# Altium schematic sheet Вариант5.SchDoc
size A4; SheetNumber: 5; SheetTotal: 10
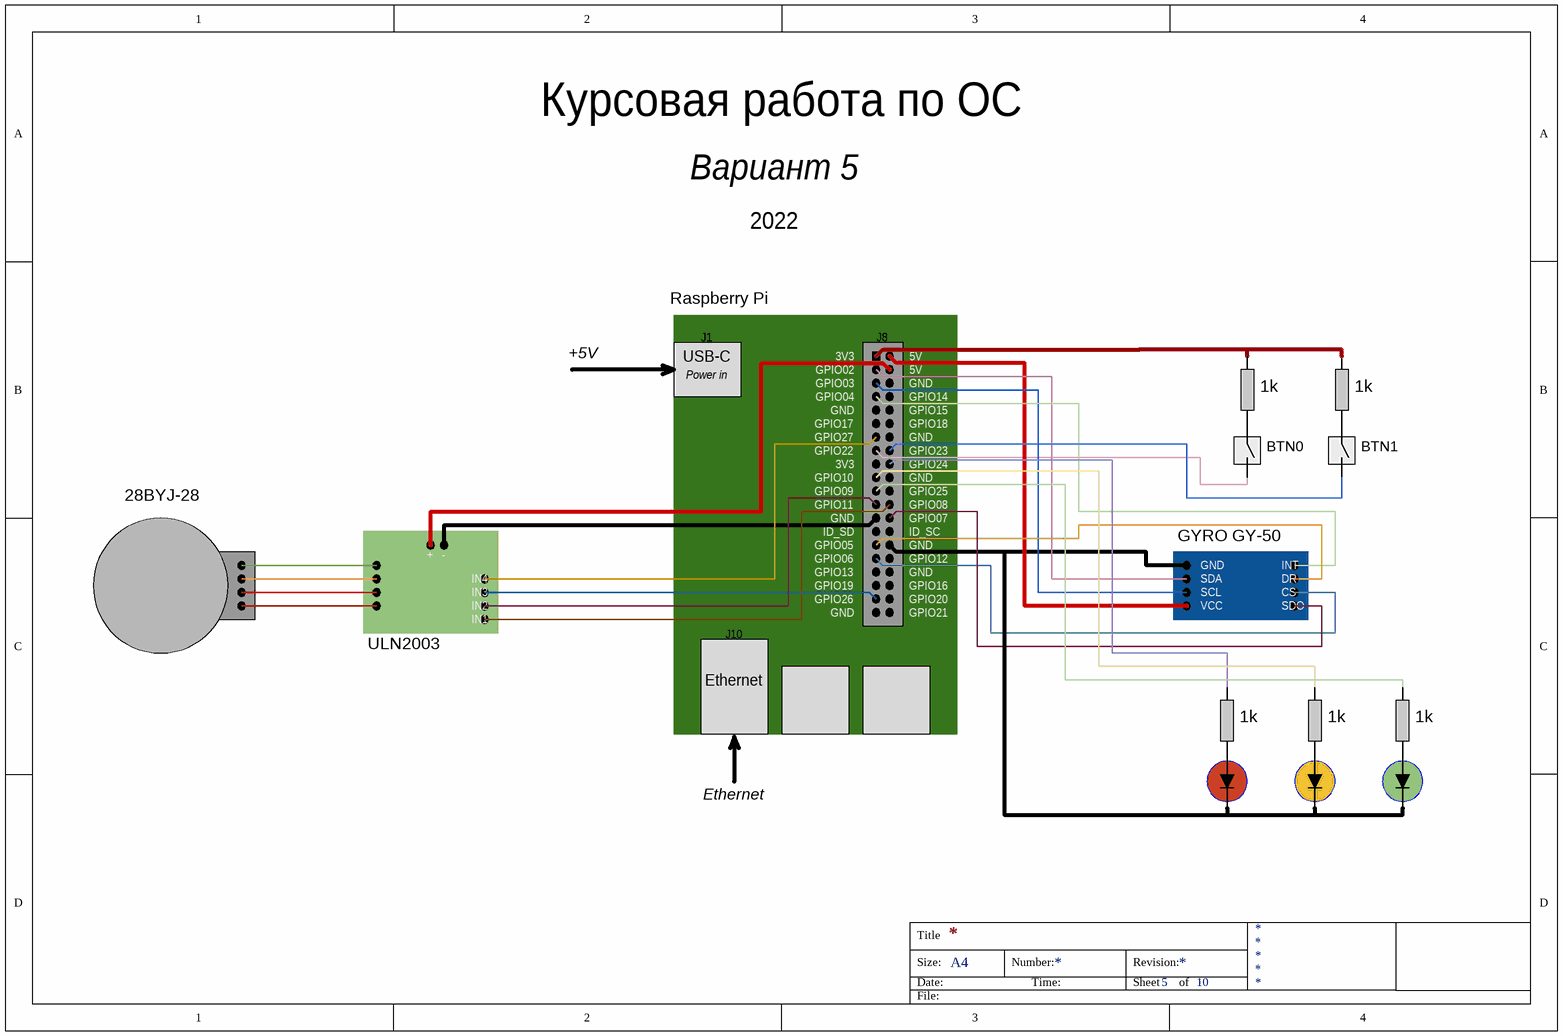
[diagram p0: Вариант5.SchDoc]

## Notes on the sheet
- Курсовая работа по ОС
- Вариант 5
- 2022
- Raspberry Pi
- +5V
- USB-C
- Power in
- J1
- 3V3
- GPIO02
- GPIO03
- J8
- GND
- 5V
- 1k
- GPIO17
- GPIO27
- GPIO22
- GPIO04
- GPIO14
- GPIO15
- GPIO18
- GPIO23
- BTN0
- BTN1
- 28BYJ-28
- GPIO09
- GPIO10
- GPIO11
- GPIO24
- GPIO25
- GPIO08
- GPIO07
- +
- -
- IN4
- GPIO05
- GPIO06
- GPIO13
- GPIO19
- ID_SD
- ID_SC
- GPIO12
- GPIO16
- GYRO GY-50
- SDA
- INT
- DR
- ULN2003
- IN3
- IN2
- IN1
- J10
- GPIO26
- GPIO20
- GPIO21
- SCL
- VCC
- CS
- SDO
- Ethernet
- Title
- Size:
- Date:
- A4
- Number:
- Time:
- Revision:
- Sheet
- of
- File: